# EAGLE design CRBN 60 (EAGLE 9.6.2)
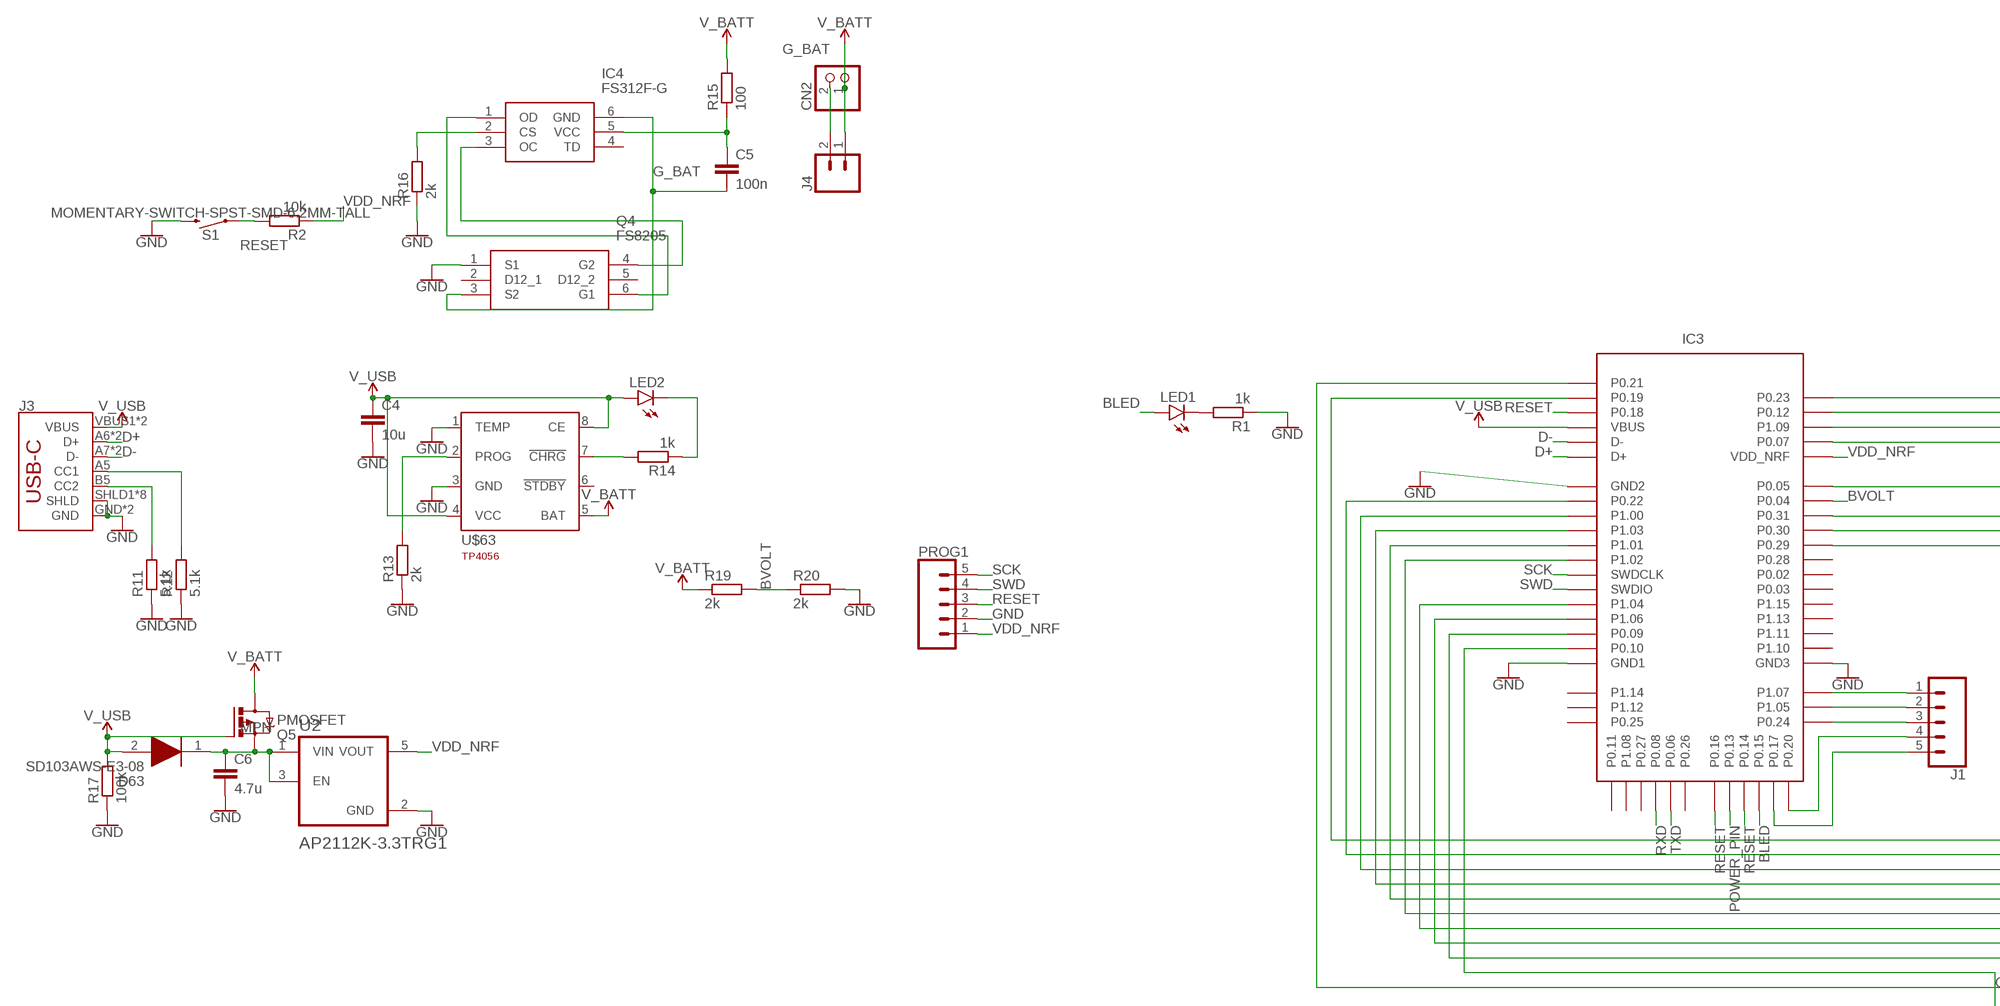
[diagram p0: schematic, sheet 1, part 1 of 2]
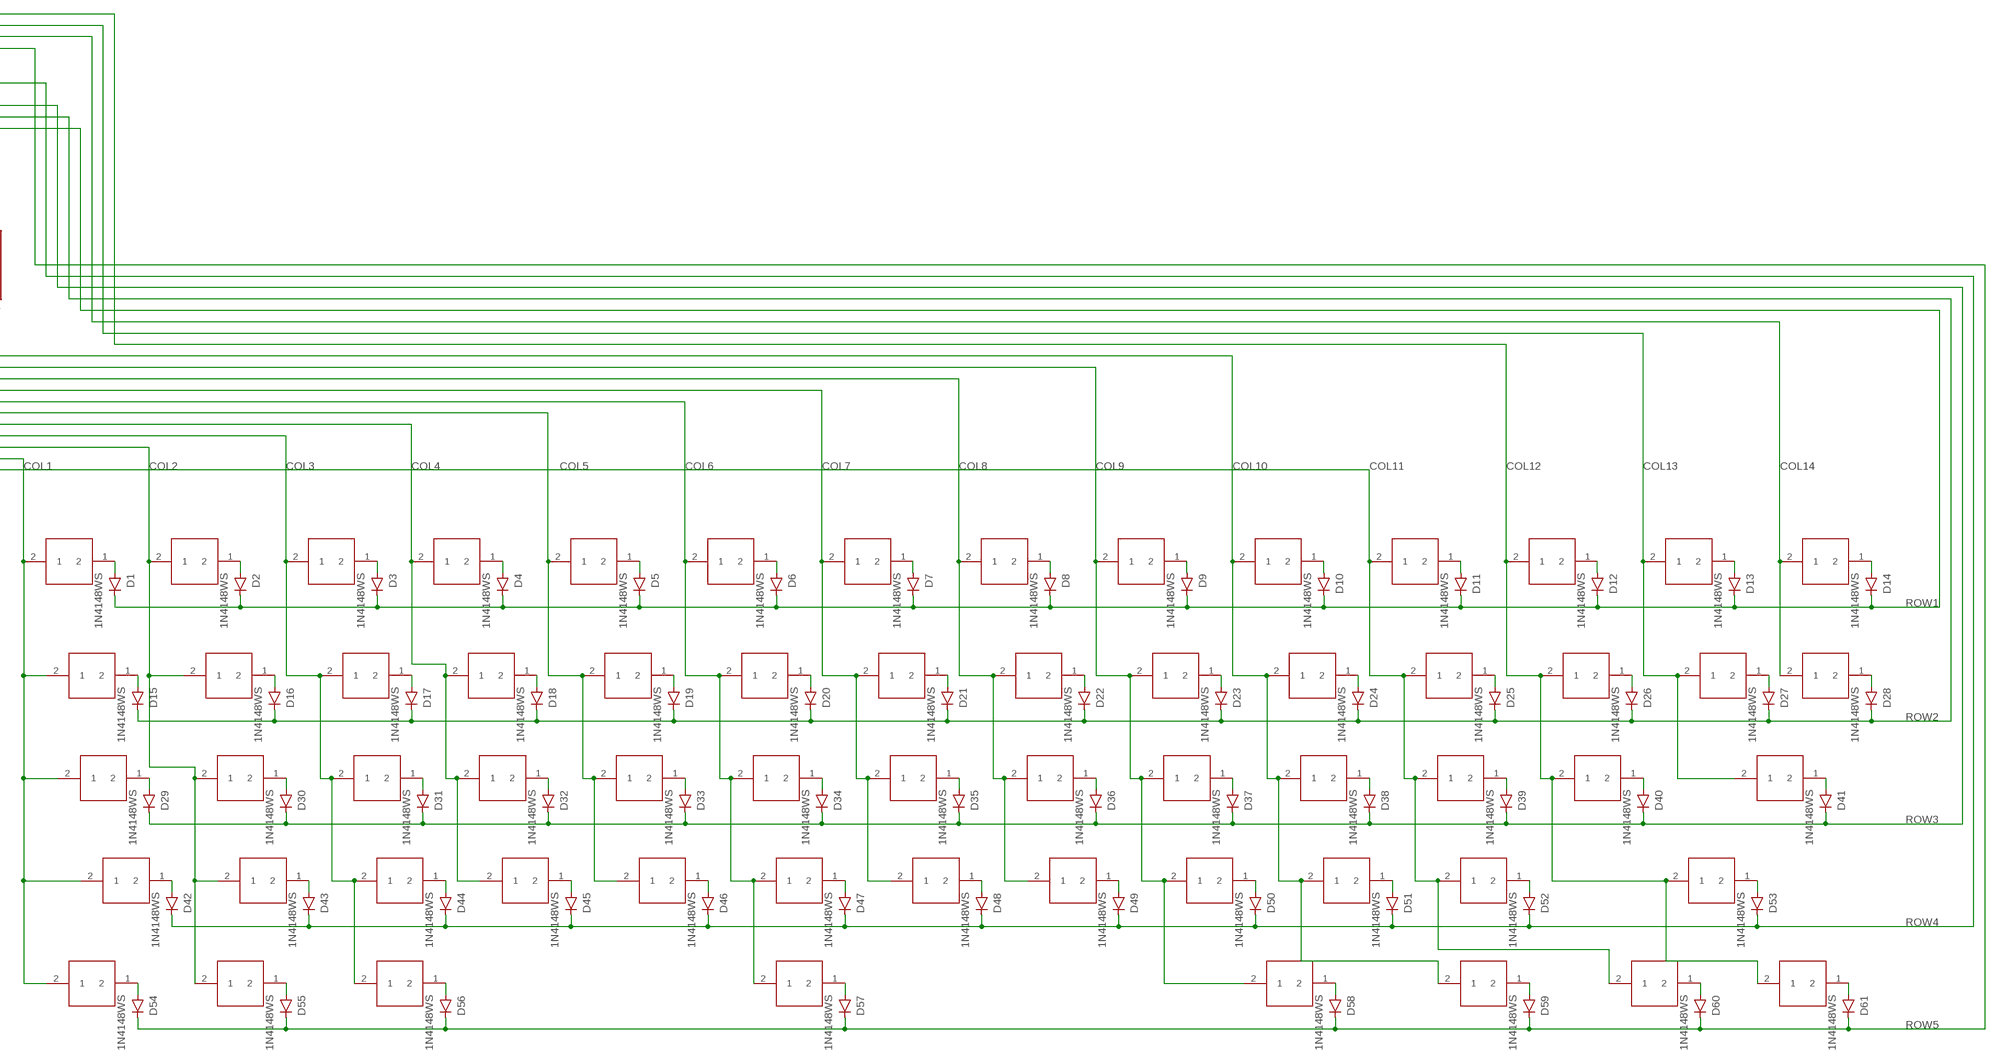
[diagram p1: schematic, sheet 1, part 2 of 2]

## Parts
C4  10u  C-EUC0603  [C0603]
C5  100n  C-EUC0603  [C0603]
C6  4.7u  C-EUC0603  [C0603]
CN2  JST_2PIN-SMT  [JST-PH-2-SMT]
D1  1N4148WS  [SOD-323]
D2  1N4148WS  [SOD-323]
D3  1N4148WS  [SOD-323]
D4  1N4148WS  [SOD-323]
D5  1N4148WS  [SOD-323]
D6  1N4148WS  [SOD-323]
D7  1N4148WS  [SOD-323]
D8  1N4148WS  [SOD-323]
D9  1N4148WS  [SOD-323]
D10  1N4148WS  [SOD-323]
D11  1N4148WS  [SOD-323]
D12  1N4148WS  [SOD-323]
D13  1N4148WS  [SOD-323]
D14  1N4148WS  [SOD-323]
D15  1N4148WS  [SOD-323]
D16  1N4148WS  [SOD-323]
D17  1N4148WS  [SOD-323]
D18  1N4148WS  [SOD-323]
D19  1N4148WS  [SOD-323]
D20  1N4148WS  [SOD-323]
D21  1N4148WS  [SOD-323]
D22  1N4148WS  [SOD-323]
D23  1N4148WS  [SOD-323]
D24  1N4148WS  [SOD-323]
D25  1N4148WS  [SOD-323]
D26  1N4148WS  [SOD-323]
D27  1N4148WS  [SOD-323]
D28  1N4148WS  [SOD-323]
D29  1N4148WS  [SOD-323]
D30  1N4148WS  [SOD-323]
D31  1N4148WS  [SOD-323]
D32  1N4148WS  [SOD-323]
D33  1N4148WS  [SOD-323]
D34  1N4148WS  [SOD-323]
D35  1N4148WS  [SOD-323]
D36  1N4148WS  [SOD-323]
D37  1N4148WS  [SOD-323]
D38  1N4148WS  [SOD-323]
D39  1N4148WS  [SOD-323]
D40  1N4148WS  [SOD-323]
D41  1N4148WS  [SOD-323]
D42  1N4148WS  [SOD-323]
D43  1N4148WS  [SOD-323]
D44  1N4148WS  [SOD-323]
D45  1N4148WS  [SOD-323]
D46  1N4148WS  [SOD-323]
D47  1N4148WS  [SOD-323]
D48  1N4148WS  [SOD-323]
D49  1N4148WS  [SOD-323]
D50  1N4148WS  [SOD-323]
D51  1N4148WS  [SOD-323]
D52  1N4148WS  [SOD-323]
D53  1N4148WS  [SOD-323]
D54  1N4148WS  [SOD-323]
D55  1N4148WS  [SOD-323]
D56  1N4148WS  [SOD-323]
D57  1N4148WS  [SOD-323]
D58  1N4148WS  [SOD-323]
D59  1N4148WS  [SOD-323]
D60  1N4148WS  [SOD-323]
D61  1N4148WS  [SOD-323]
D63  SD103AWS-E3-08  [SOD2713X115N]
IC3  HOLYIOT_18010  [PCBCOMPONENT_1]
IC4  FS312F-G  [SOT95P280X145-6N]
J1  CONN_051.27MM  [1X05_1.27MM]
J3  SPARKFUN-CONNECTORS_USB_C16PIN  [SPARKFUN-CONNECTORS_USB-C-16P]
J4  CONN_02  [1X02]
LED1  LEDSML0603  [SML0603]
LED2  LEDSML0603  [SML0603]
PROG1  CONN_05  [1X05]
Q4  FS8205  [FS8205]
Q5  PMOSFET  PMOSFET_SOT23  [SOT23]
R1  1k  R-EU_R0603  [R0603]
R2  10k  R-EU_R0603  [R0603]
R11  5.1k  R-EU_R0603  [R0603]
R12  5.1k  R-EU_R0603  [R0603]
R13  2k  R-EU_R0603  [R0603]
R14  1k  R-EU_R0603  [R0603]
R15  100  R-EU_R0603  [R0603]
R16  2k  R-EU_R0603  [R0603]
R17  100k  R-EU_R0603  [R0603]
R19  2k  R-EU_R0603  [R0603]
R20  2k  R-EU_R0603  [R0603]
S1  MOMENTARY-SWITCH-SPST-SMD-6.2MM-TALL  [TACTILE_SWITCH_SMD_6.2MM_TALL]
U2  AP2112K-3.3TRG1  [SOT95P285X140-5N]
U$1  CHERRY  [CHERRY]
U$2  CHERRY  [CHERRY]
U$3  CHERRY  [CHERRY]
U$4  CHERRY  [CHERRY]
U$5  CHERRY  [CHERRY]
U$6  CHERRY  [CHERRY]
U$7  CHERRY  [CHERRY]
U$8  CHERRY  [CHERRY]
U$9  CHERRY  [CHERRY]
U$10  CHERRY  [CHERRY]
U$11  CHERRY  [CHERRY]
U$12  CHERRY  [CHERRY]
U$13  CHERRY  [CHERRY]
U$14  CHERRY  [CHERRY]
U$15  CHERRY  [CHERRY]
U$16  CHERRY  [CHERRY]
U$17  CHERRY  [CHERRY]
U$18  CHERRY  [CHERRY]
U$19  CHERRY  [CHERRY]
U$20  CHERRY  [CHERRY]
U$21  CHERRY  [CHERRY]
U$22  CHERRY  [CHERRY]
U$23  CHERRY  [CHERRY]
U$24  CHERRY  [CHERRY]
U$25  CHERRY  [CHERRY]
U$26  CHERRY  [CHERRY]
U$27  CHERRY  [CHERRY]
U$28  CHERRY  [CHERRY]
U$29  CHERRY  [CHERRY]
U$30  CHERRY  [CHERRY]
U$31  CHERRY  [CHERRY]
U$32  CHERRY  [CHERRY]
U$33  CHERRY  [CHERRY]
U$34  CHERRY  [CHERRY]
U$35  CHERRY  [CHERRY]
U$36  CHERRY  [CHERRY]
U$37  CHERRY  [CHERRY]
U$38  CHERRY  [CHERRY]
U$39  CHERRY  [CHERRY]
U$40  CHERRY  [CHERRY]
U$41  CHERRY  [CHERRY]
U$42  CHERRY  [CHERRY]
U$43  CHERRY  [CHERRY]
U$44  CHERRY  [CHERRY]
U$45  CHERRY  [CHERRY]
U$46  CHERRY  [CHERRY]
U$47  CHERRY  [CHERRY]
U$48  CHERRY  [CHERRY]
U$49  CHERRY  [CHERRY]
U$50  CHERRY  [CHERRY]
U$51  CHERRY  [CHERRY]
U$52  CHERRY  [CHERRY]
U$53  CHERRY  [CHERRY]
U$54  CHERRY  [CHERRY]
U$55  CHERRY  [CHERRY]
U$56  CHERRY  [CHERRY]
U$57  CHERRY  [CHERRY]
U$58  CHERRY  [CHERRY]
U$59  CHERRY  [CHERRY]
U$60  CHERRY  [CHERRY]
U$61  CHERRY  [CHERRY]
U$63  TP4056  [SOT23-8]

## Nets
BLED: IC3.P0.15 LED1.A
BVOLT: IC3.P0.04 R19.2 R20.1
COL1: IC3.P0.10 U$1.2 U$15.2 U$29.2 U$42.2 U$54.2
COL2: IC3.P0.09 U$2.2 U$16.2 U$30.2 U$43.2 U$55.2
COL3: IC3.P1.06 U$3.2 U$17.2 U$31.2 U$44.2 U$56.2
COL4: IC3.P1.04 U$4.2 U$18.2 U$32.2 U$45.2
COL5: IC3.P1.02 U$5.2 U$19.2 U$33.2 U$46.2
COL6: IC3.P1.01 U$6.2 U$20.2 U$34.2 U$47.2 U$57.2
COL7: IC3.P1.03 U$7.2 U$21.2 U$35.2 U$48.2
COL8: IC3.P1.00 U$8.2 U$22.2 U$36.2 U$49.2
COL9: IC3.P0.22 U$9.2 U$23.2 U$37.2 U$50.2 U$58.2
COL10: IC3.P0.19 U$10.2 U$24.2 U$38.2 U$51.2 U$59.2
COL11: IC3.P0.21 U$11.2 U$25.2 U$39.2 U$52.2 U$60.2
COL12: IC3.P0.23 U$12.2 U$26.2 U$40.2 U$53.2 U$61.2
COL13: IC3.P0.12 U$13.2 U$27.2 U$41.2
COL14: IC3.P1.09 U$14.2 U$28.2
D+: IC3.D+ J3.A6(D+) J3.B6(D+)
D-: IC3.D- J3.A7(D-) J3.B7(D-)
G_BAT: C5.2 CN2.2 IC4.6(GND) J4.2 Q4.3(S2)
GND: C4.2 C6.2 IC3.GND1(GND2) IC3.GND2(GND3) IC3.GND(GND1) J3.GND J3.GND2(GND) J3.SHLD1(SHLD) J3.SHLD2(SHLD) J3.SHLD3(SHLD) J3.SHLD4(SHLD) J3.SHLD5(SHLD) J3.SHLD6(SHLD) J3.SHLD7(SHLD) J3.SHLD8(SHLD) PROG1.2 Q4.1(S1) R1.1 R11.1 R12.1 R13.1 R16.1 R17.1 R20.2 S1.B2 U2.2(GND) U$63.1(TEMP) U$63.3(GND)
N$1: D1.A U$1.1
N$2: LED1.C R1.2
N$3: D14.A U$14.1
N$4: D13.A U$13.1
N$5: D12.A U$12.1
N$6: D11.A U$11.1
N$7: D10.A U$10.1
N$8: D9.A U$9.1
N$9: D8.A U$8.1
N$10: D7.A U$7.1
N$11: D6.A U$6.1
N$12: D5.A U$5.1
N$13: D4.A U$4.1
N$14: D3.A U$3.1
N$15: D2.A U$2.1
N$16: D15.A U$15.1
N$17: IC3.P1.07 J1.1
N$18: D28.A U$28.1
N$19: D27.A U$27.1
N$20: D26.A U$26.1
N$21: D25.A U$25.1
N$22: D24.A U$24.1
N$23: D23.A U$23.1
N$24: D22.A U$22.1
N$25: D21.A U$21.1
N$26: D20.A U$20.1
N$27: D19.A U$19.1
N$28: D18.A U$18.1
N$29: D17.A U$17.1
N$30: D16.A U$16.1
N$31: D29.A U$29.1
N$32: IC3.P1.05 J1.2
N$33: D41.A U$41.1
N$34: D40.A U$40.1
N$35: D39.A U$39.1
N$36: D38.A U$38.1
N$37: D37.A U$37.1
N$38: D36.A U$36.1
N$39: D35.A U$35.1
N$40: D34.A U$34.1
N$41: D33.A U$33.1
N$42: D32.A U$32.1
N$43: D31.A U$31.1
N$44: D30.A U$30.1
N$45: D42.A U$42.1
N$46: IC3.P0.24 J1.3
N$47: D53.A U$53.1
N$48: D52.A U$52.1
N$49: D51.A U$51.1
N$50: D50.A U$50.1
N$51: D49.A U$49.1
N$52: D48.A U$48.1
N$53: D47.A U$47.1
N$54: D46.A U$46.1
N$55: D45.A U$45.1
N$56: D44.A U$44.1
N$57: D43.A U$43.1
N$58: D54.A U$54.1
N$59: IC3.P0.20 J1.4
N$60: D61.A U$61.1
N$61: D60.A U$60.1
N$62: D59.A U$59.1
N$63: D58.A U$58.1
N$64: D57.A U$57.1
N$65: D56.A U$56.1
N$66: D55.A U$55.1
N$67: IC3.P0.17 J1.5
N$72: J3.B5(CC2) R11.2
N$73: J3.A5(CC1) R12.2
N$74: R13.2 U$63.2(PROG)
N$75: LED2.C R14.1
N$76: R14.2 U$63.7(!CHRG)
N$77: IC4.1(OD) Q4.6(G1)
N$78: IC4.3(OC) Q4.4(G2)
N$79: C5.1 IC4.5(VCC) R15.1
N$80: IC4.2(CS) R16.2
N$81: C6.1 D63.1(K) Q5.2(S) U2.1(VIN) U2.3(EN)
POWER_PIN: IC3.P0.13
RESET: IC3.P0.14 IC3.P0.16 IC3.P0.18 PROG1.3 R2.2 S1.A2
ROW1: D1.C D2.C D3.C D4.C D5.C D6.C D7.C D8.C D9.C D10.C D11.C D12.C D13.C D14.C IC3.P0.29
ROW2: D15.C D16.C D17.C D18.C D19.C D20.C D21.C D22.C D23.C D24.C D25.C D26.C D27.C D28.C IC3.P0.30
ROW3: D29.C D30.C D31.C D32.C D33.C D34.C D35.C D36.C D37.C D38.C D39.C D40.C D41.C IC3.P0.31
ROW4: D42.C D43.C D44.C D45.C D46.C D47.C D48.C D49.C D50.C D51.C D52.C D53.C IC3.P0.05
ROW5: D54.C D55.C D56.C D57.C D58.C D59.C D60.C D61.C IC3.P0.07
RXD: IC3.P0.08
SCK: IC3.SWDCLK PROG1.5
SWD: IC3.SWDIO PROG1.4
TXD: IC3.P0.06
V_BATT: CN2.1 J4.1 Q5.3(D) R15.2 R19.1 U$63.5(BAT)
V_USB: C4.1 D63.2(A) IC3.VBUS J3.VBUS1(VBUS) J3.VBUS2(VBUS) LED2.A Q5.1(G) R17.2 U$63.4(VCC) U$63.8(CE)
VDD_NRF: IC3.VDD_NRF PROG1.1 R2.1 U2.5(VOUT)
Unconnected: IC3.P0.02 IC3.P0.03 IC3.P0.11 IC3.P0.25 IC3.P0.26 IC3.P0.27 IC3.P0.28 IC3.P1.08 IC3.P1.10 IC3.P1.11 IC3.P1.12 IC3.P1.13 IC3.P1.14 IC3.P1.15 IC4.4(TD) Q4.2(D12_1) Q4.5(D12_2) U$63.6(!STDBY)

## Library data of the parts
C4-C6 = resistor:C-EU: CAPACITOR, European symbol
CN2 = adafruit:JST_2PIN: JST 2-Pin Connectors of various flavors SMT-RA (S2B-PH-SM4) 4UConnector #17311 SMT (B2B-PH-SM4) THM-RA (S2B-PH) THM (B2B-PH)
D1-D61 = Diodes:1N4148WS: DIODE GEN PURP 75V 150MA SOD323F Manufacturer's datasheet <https://www.onsemi.com/pub/Collateral/1N914BWS-D.pdf>; CREATED_BY: PCBLayout.com; DIGIKEY_PART_NUMBER: 1N4148WSFSTR-ND; MANUFACTURER: Diodes Incorporated; MPN: 1N4148WS; PACKAGE: SOD-323
D63 = SD103AWS-E3-08:SD103AWS-E3-08: Vishay SD103AWS-E3-08, SMT Schottky Diode, 40V 350mA, 10ns, 2-Pin SOD-323 Source: Datasheet <http://www.vishay.com/docs/85682/sd103aws.pdf>; ARROW_PART_NUMBER: SD103AWS-E3-08; ARROW_PRICE-STOCK: https://www.arrow.com/en/products/sd103aws-e3-08/vishay; DESCRIPTION: Vishay SD103AWS-E3-08, SMT Schottky Diode, 40V 350mA, 10ns, 2-Pin SOD-323; HEIGHT: 1.15mm; MANUFACTURER_NAME: Vishay; MANUFACTURER_PART_NUMBER: SD103AWS-E3-08; MOUSER_PART_NUMBER: 78-SD103AWS-E3-08; MOUSER_PRICE-STOCK: https://www.mouser.co.uk/ProductDetail/Vishay-Semiconductors/SD103AWS-E3-08?qs=S660mHfF5o1xcba7ic5A%252BA%3D%3D
IC3 = HOLYIOT-18010-VER1.0-0.8MM:HOLYIOT_18010
IC4 = FS312F-G:FS312F-G: Battery Protection ICs SOT-23-6 RoHS Source: Datasheet <https://lcsc.com/product-detail/Battery-Protection-ICs_FS312F-G_C82736.html>; DESCRIPTION: Battery Protection ICs SOT-23-6 RoHS; HEIGHT: 1.45mm; MANUFACTURER_NAME: Fortune Semicon; MANUFACTURER_PART_NUMBER: FS312F-G
J1 PROG1 = SparkFun-Connectors:CONN_05: Multi connection point. Often used as Generic Header-pin footprint for 0.1 inch spaced/style header connections On any of the 0.1 inch spaced packages, you can populate with these: Break Away Headers - Straight <https://www.sparkfun.com/products/116> (PRT-00116) Break Away Male Headers - Right Angle <https://www.sparkfun.com/products/553> (PRT-00553) Female Headers <https://www.sparkfun.com/products/115> (PRT-00115) Break Away Headers - Machine Pin <https://www.sparkfun.com/products/117> (PRT-00117) Break Away Female Headers - Swiss Machine Pin <https://www.sparkfun.com/products/743> (PRT-00743) For SCREWTERMINALS and SPRING TERMINALS visit here: Screw Terimnals on SparkFun.com <https://www.sparkfun.com/search/results?term=Screw+Terminals> (5mm/3.5mm/2.54mm spacing) This device is also useful as a general connection point to wire up your design to another part of your project. Our various solder wires solder well into these plated through hole pads. Hook-Up Wire - Assortment (Stranded, 22 AWG) <https://www.sparkfun.com/products/11375> (PRT-11375) Hook-Up Wire - Assortment (Solid Core, 22 AWG) <https://www.sparkfun.com/products/11367> (PRT-11367) View the entire wire category on our website here <https://www.sparkfun.com/categories/141> Special notes: Molex polarized connector foot print use with SKU : PRT-08231 with associated crimp pins and housings. 1MM SMD Version SKU: PRT-10208
J3 = USB-C-Breakout:SPARKFUN-CONNECTORS_USB_C: USB Type C 16Pin Connector Super Speed pins not available on the 16-pin purely SMD connector so this part is best for USB 2.0 implementations. D1 and D2 are tied together enabling D+/- no matter which way the cable is plugged into the connector. The two channel configuration pins (CC1/2) are exposed. These are normally connected to ground via 5.1k resistors but can be reconfigured for high current/high power applications.; PROD_ID: CONN-14122
J4 = SparkFun-Connectors:CONN_02: Multi connection point. Often used as Generic Header-pin footprint for 0.1 inch spaced/style header connections On any of the 0.1 inch spaced packages, you can populate with these: Break Away Headers - Straight <https://www.sparkfun.com/products/116> (PRT-00116) Break Away Male Headers - Right Angle <https://www.sparkfun.com/products/553> (PRT-00553) Female Headers <https://www.sparkfun.com/products/115> (PRT-00115) Break Away Headers - Machine Pin <https://www.sparkfun.com/products/117> (PRT-00117) Break Away Female Headers - Swiss Machine Pin <https://www.sparkfun.com/products/743> (PRT-00743) For SCREWTERMINALS and SPRING TERMINALS visit here: Screw Terimnals on SparkFun.com <https://www.sparkfun.com/search/results?term=Screw+Terminals> (5mm/3.5mm/2.54mm spacing) This device is also useful as a general connection point to wire up your design to another part of your project. Our various solder wires solder well into these plated through hole pads. Hook-Up Wire - Assortment (Stranded, 22 AWG) <https://www.sparkfun.com/products/11375> (PRT-11375) Hook-Up Wire - Assortment (Solid Core, 22 AWG) <https://www.sparkfun.com/products/11367> (PRT-11367) View the entire wire category on our website here <https://www.sparkfun.com/categories/141> Special notes: Molex polarized connector foot print use with: PRT-08233 with associated crimp pins and housings. 2.54_SCREWTERM for use with PRT-10571. 3.5mm Screw Terminal footprints for PRT-08084 5mm Screw Terminal footprints for use with PRT-08432
LED1 LED2 = led:LED: LED OSRAM: - CHIPLED LG R971, LG N971, LY N971, LG Q971, LY Q971, LO R971, LY R971 LH N974, LH R974 LS Q976, LO Q976, LY Q976 LO Q996 - Hyper CHIPLED LW Q18S LB Q993, LB Q99A, LB R99A - SideLED LS A670, LO A670, LY A670, LG A670, LP A670 LB A673, LV A673, LT A673, LW A673 LH A674 LY A675 LS A676, LA A676, LO A676, LY A676, LW A676 LS A679, LY A679, LG A679 - Hyper Micro SIDELED® LS Y876, LA Y876, LO Y876, LY Y876 LT Y87S - SmartLED LW L88C, LW L88S LB L89C, LB L89S, LG L890 LS L89K, LO L89K, LY L89K LS L896, LA L896, LO L896, LY L896 - TOPLED LS T670, LO T670, LY T670, LG T670, LP T670 LSG T670, LSP T670, LSY T670, LOP T670, LYG T670 LG T671, LOG T671, LSG T671 LB T673, LV T673, LT T673, LW T673 LH T674 LS T676, LA T676, LO T676, LY T676, LB T676, LH T676, LSB T676, LW T676 LB T67C, LV T67C, LT T67C, LS T67K, LO T67K, LY T67K, LW E67C LS E67B, LA E67B, LO E67B, LY E67B, LB E67C, LV E67C, LT E67C LW T67C LS T679, LY T679, LG T679 LS T770, LO T770, LY T770, LG T770, LP T770 LB T773, LV T773, LT T773, LW T773 LH T774 LS E675, LA E675, LY E675, LS T675 LS T776, LA T776, LO T776, LY T776, LB T776 LHGB T686 LT T68C, LB T68C - Hyper Mini TOPLED® LB M676 - Mini TOPLED Santana® LG M470 LS M47K, LO M47K, LY M47K Source: http://www.osram.convergy.de LUXEON: - LUMILED® LXK2-PW12-R00, LXK2-PW12-S00, LXK2-PW14-U00, LXK2-PW14-V00 LXK2-PM12-R00, LXK2-PM12-S00, LXK2-PM14-U00 LXK2-PE12-Q00, LXK2-PE12-R00, LXK2-PE12-S00, LXK2-PE14-T00, LXK2-PE14-U00 LXK2-PB12-K00, LXK2-PB12-L00, LXK2-PB12-M00, LXK2-PB14-N00, LXK2-PB14-P00, LXK2-PB14-Q00 LXK2-PR12-L00, LXK2-PR12-M00, LXK2-PR14-Q00, LXK2-PR14-R00 LXK2-PD12-Q00, LXK2-PD12-R00, LXK2-PD12-S00 LXK2-PH12-R00, LXK2-PH12-S00 LXK2-PL12-P00, LXK2-PL12-Q00, LXK2-PL12-R00 Source: www.luxeon.com KINGBRIGHT: KA-3528ASYC Source: www.kingbright.com
Q4 = FS8205:FS8205: DUAL N-CHANNEL ENHANCEMENT MODE POWER MOFSET Source: Datasheet <https://www.ic-fortune.com/upload/Download/FS8205-DS-19_EN.pdf>; DESCRIPTION: DUAL N-CHANNEL ENHANCEMENT MODE POWER MOFSET; HEIGHT: 1mm; MANUFACTURER_NAME: Fortune Semiconductor Corporation; MANUFACTURER_PART_NUMBER: FS8205
Q5 = Transistor:PMOSFET: P-Channel MOSFET - Generic; CATEGORY: Transistor; MPN: SL2301S; SUB-CATEGORY: MOSFET; TYPE: P-Channel
R1 R2 R11-R17 R19 R20 = rcl:R-EU_: RESISTOR, European symbol; SPICEPREFIX: R
S1 = SparkFun-Switches:MOMENTARY-SWITCH-SPST: Momentary Switch (Pushbutton) - SPST Normally-open (NO) SPST momentary switches (buttons, pushbuttons). Variants PTH-12MM - 12mm square, through-hole Momentary Pushbutton Switch - 12mm Square <https://www.sparkfun.com/products/9190> (COM-09190) PTH-6.0MM, PTH-6.0MM-KIT - 6.0mm square, through-hole Mini Pushbutton Switch <https://www.sparkfun.com/products/97> (COM-00097) KIT package intended for soldering kit's - only one side of pads' copper is exposed. PTH-RIGHT-ANGLE-KIT - Right-angle, through-hole Right Angle Tactile Button <https://www.sparkfun.com/products/10791> - Used on SparkFun BigTime Watch Kit <https://www.sparkfun.com/products/11734> SMD-12MM - 12mm square, surface-mount Tactile Button - SMD (12mm) <https://www.sparkfun.com/products/12993> (COM-12993) Used on SparkFun PicoBoard <https://www.sparkfun.com/products/11888> SMD-4.5MM - 4.5mm Square Trackball Switch Used on SparkFun Blackberry Trackballer Breakout <https://www.sparkfun.com/products/13169> SMD-4.6MMX2.8MM - 4.60mm x 2.80mm, surface mount Used on SparkFun SAMD21 Mini Breakout <https://www.sparkfun.com/products/13664> SMD-5.2MM, SMD-5.2-REDUNDANT - 5.2mm square, surface-mount Mini Pushbutton Switch - SMD <https://www.sparkfun.com/products/8720> (COM-08720) Used on Arduino Pro Mini <https://www.sparkfun.com/products/11114> REDUNDANT package connects both switch circuits together SMD-6.0X3.5MM - 6.0 x 3.5mm, surface mount Momentary Reset Switch SMD <https://www.sparkfun.com/products/8229> (COM-08229) SMD-6.2MM-TALL - 6.2mm square, surface mount Tactile Button - SMD (6mm) <https://www.sparkfun.com/products/12992> Used on SparkFun Digital Sandbox <https://www.sparkfun.com/products/12651> SMD-RIGHT-ANGLE - Right-angle, surface mount Used on SparkFun Block for Intel® Edison - Arduino <https://www.sparkfun.com/products/13036>; PROD_ID: SWCH-11966; SF_SKU: COM-12992
U2 = AP2112K-3.3TRG1:AP2112K-3.3TRG1: AP2112 Series 0.6 A 3.3 V Fixed Output SMT LDO Linear Regulator - SOT23-5 Check prices <https://pricing.snapeda.com/parts/AP2112K-3.3TRG1/Diodes%20Inc./view-part?ref=eda>; AVAILABILITY: Good; DESCRIPTION: Linear Voltage Regulator IC 1 Output 600mA SOT-25; MF: Diodes Inc.; MP: AP2112K-3.3TRG1; PACKAGE: SOT-753 Diodes Inc.; PRICE: None; PURCHASE-URL: https://pricing.snapeda.com/search/part/AP2112K-3.3TRG1/?ref=eda
U$1-U$61 = Volume_V1:CHERRY
U$63 = TP4056:TP4056: TP4056 Data sheet <http://goo.gl/J7k8TF> Dave.Calaway Eagle Library <https://goo.gl/Muy1Tr>

## Board
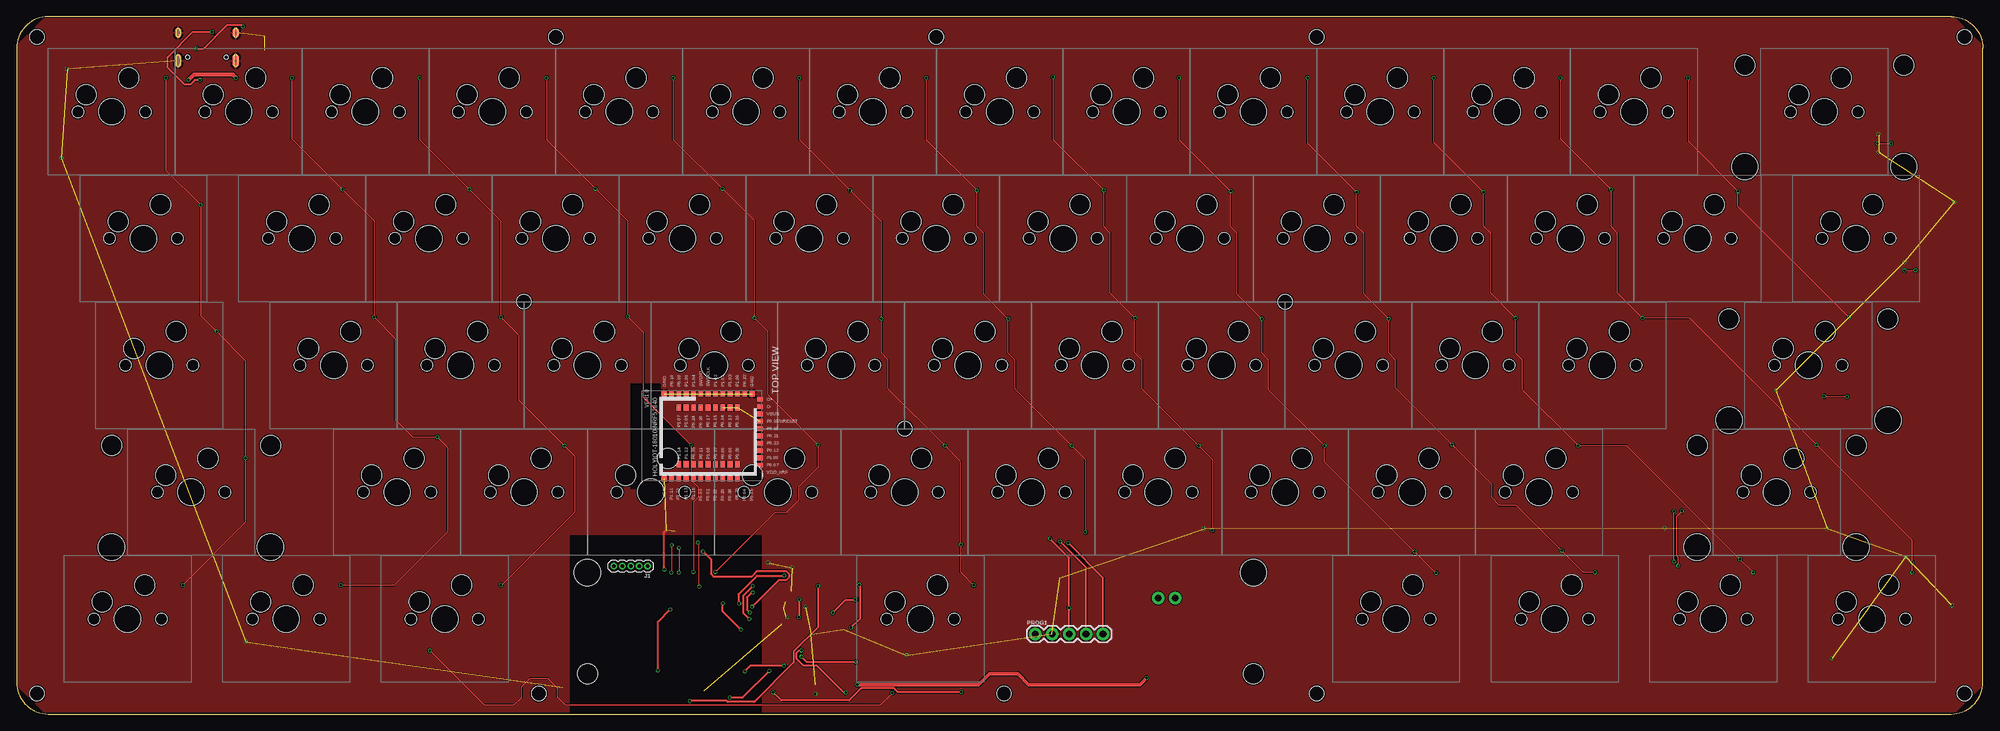
[diagram p2: board, top side]
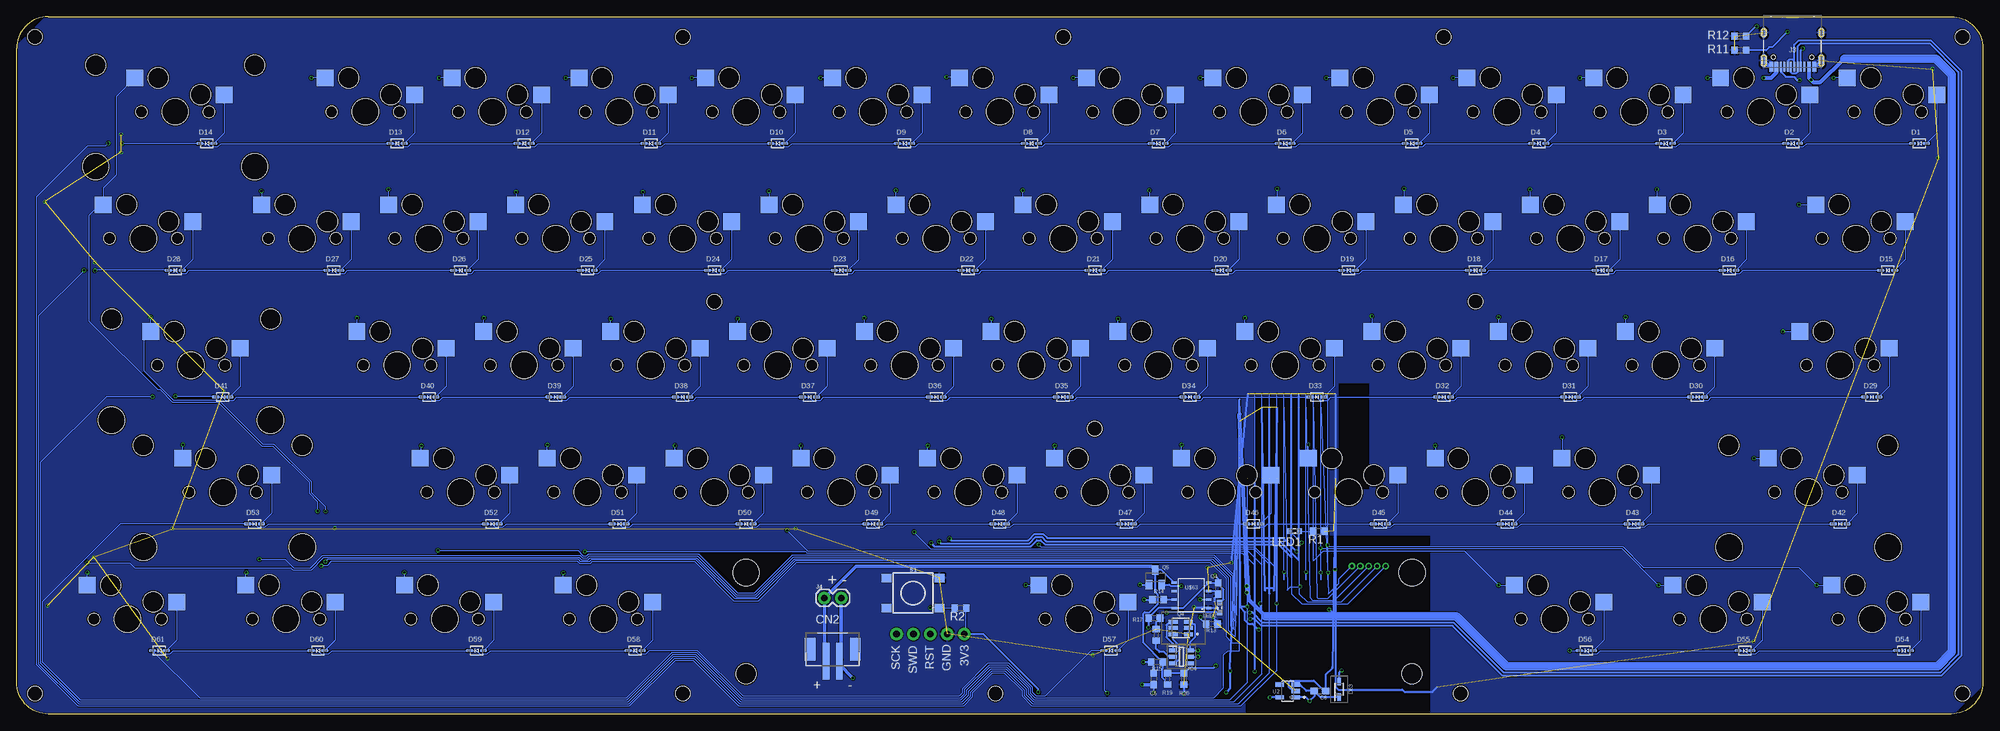
[diagram p3: board, bottom side, seen from below]

Size 295.28 x 104.78 mm. Coordinates in mm from the lower left corner, seen from the top.
Outline: 0,100.01 0,4.76 arc90 4.76,0 290.51,0 arc90 295.28,4.76 295.28,100.01 arc90 290.51,104.78 4.76,104.78 arc90 0,100.01
Copper layers (1*16): Top 0.035559375mm / dielectric 1.6mm / Bottom 0.035559375mm
Design rules "jlcpcb2layer": minimum track width 5mil, minimum drill 12mil, track to track 5mil, track to pad 5mil, pad to pad 5mil, via to via 5mil, smd to smd 5mil, copper to edge 8mil, drill to drill 6mil, minimum pad ring 5mil, minimum via ring 3mil, stop-mask expansion 2.5mil, vias tented up to drill 0mil, thermal gap 10mil
Holes 3.05 mm at 38.13,40.32 14.26,40.32 276.26,40.32 252.38,40.32 281.02,59.37 257.14,59.37 283.4,97.47 259.52,97.47 185.73,6.03 85.73,6.03
Holes 3.99 mm at 38.13,25.08 14.26,25.08 276.26,25.08 252.38,25.08 281.02,44.13 257.14,44.13 283.4,82.23 259.52,82.23 185.73,21.27 85.73,21.27
Holes 2.2 mm at 3.08,3.08 3.08,101.7 292.51,101.7 292.51,3.08 138.11,101.7 80.96,101.7 195.26,101.7 78.42,3.08 148.27,3.08 195.26,3.08 76.2,61.97 133.35,42.86 190.5,61.91

### Footprints (pad centres in the part's own frame; a part is rotated, then mirrored left to right if it is on the bottom)
C0603 = smd 1.1 x 1: 1 -0.85,0; 2 0.85,0
JST-PH-2-SMT = smd 1 x 5.5: 1 -1,-1.8; 2 1,-1.8 | smd 1.6 x 3.4: NC1 -3.4,0; NC2 3.4,0
SOD-323 = smd 1.14 x 0.52: A 1.04,0; C -1.04,0
SOD2713X115N = smd 1.125 x 0.5: 1 -1.162,0; 2 1.162,0
PCBCOMPONENT_1 = smd 0.7 x 0.9: D+ 40.127,0.284; D- 39.027,0.284; P0.07 30.227,0.284; P0.12 32.427,0.284; P0.18 36.827,0.284; P0.19 35.727,0.284; P0.21 34.627,0.284; P0.23 33.527,0.284; P1.09 31.327,0.284; VBUS 37.927,0.284; VDD_NRF 29.127,0.284 | smd 0.9 x 0.7: GND 28.277,14.684; GND1 40.977,1.484; GND2 40.977,14.684; P0.02 28.277,8.084; P0.03 28.277,9.184; P0.04 28.277,2.584; P0.05 28.277,1.484; P0.09 40.977,12.484; P0.10 40.977,13.584; P0.22 40.977,2.584; P0.28 28.277,6.984; P0.29 28.277,5.884; P0.30 28.277,4.784; P0.31 28.277,3.684; P1.00 40.977,3.684; P1.01 40.977,5.884; P1.02 40.977,6.984; P1.03 40.977,4.784; P1.04 40.977,10.284; P1.06 40.977,11.384; P1.10 28.277,12.484; P1.11 28.277,13.584; P1.13 28.277,11.384; P1.15 28.277,10.284; SWDCLK 40.977,8.084; SWDIO 40.977,9.184 | smd 1 x 0.7: P0.06 30.377,4.784; P0.08 30.377,5.884; P0.11 30.377,9.184; P0.13 38.877,4.784; P0.14 38.877,5.884; P0.15 38.877,6.984; P0.16 38.877,3.684; P0.17 38.877,8.084; P0.25 30.377,10.284; P0.26 30.377,3.684; P0.27 30.377,6.984; P1.05 38.877,11.384; P1.07 38.877,12.484; P1.08 30.377,8.084; P1.12 30.377,11.384; P1.14 30.377,12.484 | smd 1 x 0.6: P0.20 38.877,9.184; P0.24 38.877,10.284
SOT95P280X145-6N = smd 1.2 x 0.6: 1 -1.25,0.95; 2 -1.25,0; 3 -1.25,-0.95; 4 1.25,-0.95; 5 1.25,0; 6 1.25,0.95
1X05_1.27MM = drill 0.508 pad 1: 1 0,0; 2 1.27,0; 3 2.54,0; 4 3.81,0; 5 5.08,0
SPARKFUN-CONNECTORS_USB-C-16P = smd 0.3 x 1.45: A5 -1.25,0; A6 -0.25,0; A7 0.25,0; A8 1.25,0; B5 1.75,0; B6 0.75,0; B7 -0.75,0; B8 -1.75,0 | smd 0.6 x 1.45: GND -3.225,0; GND2 3.225,0 | smd 1 x 2.1: SHLD1 -4.32,-0.915; SHLD2 4.32,-0.915 | smd 1 x 2.1 bottom: SHLD3 -4.32,-0.915; SHLD4 4.32,-0.915 | smd 1 x 1.6: SHLD5 -4.32,-5.095; SHLD8 4.32,-5.095 | smd 1 x 1.6 bottom: SHLD6 -4.32,-5.095; SHLD7 4.32,-5.095 | smd 0.55 x 1.45: VBUS1 -2.45,0; VBUS2 2.45,0 | hole 0.65: -2.89,-1.445; 2.89,-1.445
1X02 = drill 1.016 pad 1.88: 1 0,0; 2 2.54,0
SML0603 = smd 0.8 x 0.8: A 0.75,0; C -0.75,0
1X05 = drill 1.016 pad 1.88: 1 0,0; 2 2.54,0; 3 5.08,0; 4 7.62,0; 5 10.16,0
FS8205 = smd 1.4 x 0.6: 1 -0.5,0.95; 2 -0.5,0; 3 -0.5,-0.95; 4 1.8,0.95; 5 1.8,0; 6 1.8,-0.95
SOT23 = smd 1 x 1.4: 1 -0.95,-1.1; 2 0.95,-1.1; 3 0,1.1
R0603 = smd 1 x 1.1: 1 -0.85,0; 2 0.85,0
TACTILE_SWITCH_SMD_6.2MM_TALL = smd 1.55 x 1.3: A1 -3.975,-2.25; A2 3.975,-2.25; B1 -3.975,2.25; B2 3.975,2.25
SOT95P285X140-5N = smd 1.35 x 0.6: 1 -1.185,0.95; 2 -1.185,0; 3 -1.185,-0.95; 4 1.185,-0.95; 5 1.185,0.95
CHERRY = smd 2.55 x 2.5 bottom: 1 -7.37,2.54; 2 6.05,5.08 | hole 3.988: 0,0 | hole 1.753: 5.08,0; -5.08,0 | hole 3.048: -3.81,2.54; 2.54,5.08
SOT23-8 = smd 0.42 x 0.835: 1 -1.905,-2.58; 2 -0.635,-2.58; 3 0.635,-2.58; 4 1.905,-2.58; 5 1.905,2.58; 6 0.635,2.58; 7 -0.635,2.58; 8 -1.905,2.58

### Placement (x,y rotation side)
C4  114.83,18.85 270 bottom
C5  124.5,5.26 270 bottom
C6  99.56,3.46 0 bottom
CN2  172.73,9.73 0 bottom
D1  9.52,85.72 0 bottom
D2  28.57,85.72 0 bottom
D3  47.62,85.72 0 bottom
D4  66.67,85.72 0 bottom
D5  85.72,85.72 0 bottom
D6  104.77,85.72 0 bottom
D7  123.82,85.72 0 bottom
D8  142.88,85.72 0 bottom
D9  161.92,85.72 0 bottom
D10  180.97,85.72 0 bottom
D11  200.03,85.72 0 bottom
D12  219.07,85.72 0 bottom
D13  238.12,85.72 0 bottom
D14  266.7,85.72 0 bottom
D15  14.29,66.67 0 bottom
D16  38.1,66.67 0 bottom
D17  57.15,66.67 0 bottom
D18  76.2,66.67 0 bottom
D19  95.25,66.67 0 bottom
D20  114.3,66.67 0 bottom
D21  133.35,66.67 0 bottom
D22  152.4,66.67 0 bottom
D23  171.45,66.67 0 bottom
D24  190.5,66.67 0 bottom
D25  209.55,66.67 0 bottom
D26  228.6,66.67 0 bottom
D27  247.65,66.67 0 bottom
D28  271.46,66.67 0 bottom
D29  16.67,47.62 0 bottom
D30  42.86,47.62 0 bottom
D31  61.91,47.62 0 bottom
D32  80.96,47.62 0 bottom
D33  100.01,47.62 0 bottom
D34  119.06,47.62 0 bottom
D35  138.11,47.62 0 bottom
D36  157.16,47.62 0 bottom
D37  176.21,47.62 0 bottom
D38  195.26,47.62 0 bottom
D39  214.31,47.62 0 bottom
D40  233.36,47.62 0 bottom
D41  264.32,47.62 0 bottom
D42  21.43,28.57 0 bottom
D43  52.39,28.57 0 bottom
D44  71.44,28.57 0 bottom
D45  90.49,28.57 0 bottom
D46  109.54,28.57 0 bottom
D47  128.59,28.57 0 bottom
D48  147.64,28.57 0 bottom
D49  166.69,28.57 0 bottom
D50  185.74,28.57 0 bottom
D51  204.79,28.57 0 bottom
D52  223.84,28.57 0 bottom
D53  259.56,28.57 0 bottom
D54  11.91,9.53 0 bottom
D55  35.72,9.53 0 bottom
D56  59.53,9.53 0 bottom
D57  130.97,9.53 0 bottom
D58  202.41,9.53 0 bottom
D59  226.22,9.53 0 bottom
D60  250.03,9.53 0 bottom
D61  273.84,9.53 0 bottom
D63  96.66,3.7 90 bottom
IC3  111.92,7.14 90 top
IC4  120.36,8.6 0 bottom
J1  94.75,22.23 180 top
J3  28.57,97.25 180 bottom
J4  173.98,17.42 0 bottom
LED1  103.39,27.46 180 bottom
LED2  114.6,16 90 bottom
PROG1  152.98,12.01 0 top
Q4  119.8,12.93 180 bottom
Q5  124.27,20.54 0 bottom
R1  99.71,27.46 180 bottom
R2  153.53,15.9 180 bottom
R11  36.42,99.73 0 bottom
R12  36.42,101.82 0 bottom
R13  115.79,13.52 180 bottom
R14  123.84,17.2 0 bottom
R15  124.02,7.8 0 bottom
R16  124.15,11.91 270 bottom
R17  124.43,14.43 180 bottom
R19  122.42,5.26 90 bottom
R20  119.97,5.26 270 bottom
S1  160.67,18.19 0 bottom
U2  104.39,3.46 180 bottom
U$1  14.29,90.49 0 top
U$2  33.34,90.49 0 top
U$3  52.39,90.49 0 top
U$4  71.44,90.49 0 top
U$5  90.49,90.49 0 top
U$6  109.54,90.49 0 top
U$7  128.59,90.49 0 top
U$8  147.64,90.49 0 top
U$9  166.69,90.49 0 top
U$10  185.74,90.49 0 top
U$11  204.79,90.49 0 top
U$12  223.84,90.49 0 top
U$13  242.89,90.49 0 top
U$14  271.46,90.49 0 top
U$15  19.05,71.44 0 top
U$16  42.86,71.44 0 top
U$17  61.91,71.44 0 top
U$18  80.96,71.44 0 top
U$19  100.01,71.44 0 top
U$20  119.06,71.44 0 top
U$21  138.11,71.44 0 top
U$22  157.16,71.44 0 top
U$23  176.24,71.44 0 top
U$24  195.26,71.44 0 top
U$25  214.31,71.44 0 top
U$26  233.36,71.44 0 top
U$27  252.41,71.44 0 top
U$28  276.23,71.44 0 top
U$29  21.43,52.39 0 top
U$30  47.62,52.39 0 top
U$31  66.67,52.39 0 top
U$32  85.72,52.39 0 top
U$33  104.77,52.39 0 top
U$34  123.82,52.39 0 top
U$35  142.88,52.39 0 top
U$36  161.92,52.39 0 top
U$37  180.97,52.39 0 top
U$38  200.03,52.39 0 top
U$39  219.07,52.39 0 top
U$40  238.12,52.39 0 top
U$41  269.08,52.39 0 top
U$42  26.19,33.34 0 top
U$43  57.15,33.34 0 top
U$44  76.2,33.34 0 top
U$45  95.25,33.34 0 top
U$46  114.3,33.34 0 top
U$47  133.35,33.34 0 top
U$48  152.4,33.34 0 top
U$49  171.45,33.34 0 top
U$50  190.5,33.34 0 top
U$51  209.55,33.34 0 top
U$52  228.6,33.34 0 top
U$53  264.32,33.34 0 top
U$54  16.67,14.29 0 top
U$55  40.48,14.29 0 top
U$56  64.29,14.29 0 top
U$57  135.73,14.29 0 top
U$58  207.17,14.29 0 top
U$59  230.98,14.29 0 top
U$60  254.79,14.29 0 top
U$61  278.61,14.29 0 top
U$63  118.84,17.83 90 bottom

### Tracks (layer width: path | path; a pad name or v marks a point on that pad's centre or on a via)
BLED  (via drill 0.35)  (1 unrouted)
  Top 0.152: v102.5,19.11 102.5,24.14 102.47,24.17 102.47,25.56 v102.3,25.73
  Bottom 0.152: IC3.P0.15 104.41,18.6 104.41,18.68 103.98,19.11 v102.5,19.11 | v102.3,25.73 104.03,27.46 LED1.A
BVOLT  (via drill 0.35)  (1 unrouted)
  Top 0.305: v115.2,7.25 110.17,7.25 v109.33,6.41
  Bottom 0.305: R19.2 R20.1 119.11,6.97 115.48,6.97 v115.2,7.25 | v109.33,6.41 109.33,7.48 IC3.P0.04
COL1  (via drill 0.35)  (1 unrouted)
  Top 0.152: v22.42,95.57 22.42,81.72 v27.62,76.52 27.62,59.88 v30.04,57.47 34.35,53.15 v34.35,38.42 34.35,28.77 v24.96,19.37 | v98.36,25.38 98.36,21.27 v98.34,21.25
  Bottom 0.152: U$1.2 v22.42,95.57 | v27.62,76.52 U$15.2 | v30.04,57.47 U$29.2 | v34.35,38.42 U$42.2 | U$54.2 v24.96,19.37 27.58,22 50.9,22 53.99,25.08 98.06,25.08 v98.36,25.38 | v98.34,21.25 98.34,20.18 IC3.P0.10
COL2  (via drill 0.35)  (1 unrouted)
  Top 0.152: v41.34,95.57 41.34,86.42 v48.96,78.8 53.66,74.11 v53.66,59.63 56.83,56.45 56.83,44.26 59.5,41.59 v63.18,41.59 64.71,40.07 64.71,27.37 56.71,19.37 v48.7,19.37 | v99.48,24.95 99.48,21.3 v99.43,21.25
  Bottom 0.152: U$2.2 v41.34,95.57 | v48.96,78.8 48.96,76.56 U$16.2 | v53.66,59.63 53.68,59.61 U$30.2 | v63.18,41.59 63.18,38.44 U$43.2 | U$55.2 v48.7,19.37 54.11,24.78 99.3,24.78 v99.48,24.95 | v99.43,21.25 99.43,20.19 IC3.P0.09
COL3  (via drill 0.35)  (1 unrouted)
  Top 0.152: v60.52,95.57 60.52,86.3 v68.01,78.8 72.71,74.11 v72.71,59.63 75.37,56.96 75.37,47.18 v82.23,40.32 83.76,38.8 83.76,30.29 72.83,19.37 v72.71,19.37
  Bottom 0.152: U$3.2 v60.52,95.57 | v68.01,78.8 68.01,76.56 U$17.2 | v72.71,59.63 72.73,59.61 U$31.2 | v82.23,40.32 82.25,40.3 U$44.2 | U$56.2 v72.71,19.37 77.81,24.47 99.1,24.47 100.53,23.04 IC3.P1.06
COL4  (via drill 0.35)  (1 unrouted)
  Top 0.152: v79.57,95.57 79.57,86.3 v86.93,78.93 91.76,74.11 v91.76,59.75 94.17,57.34 94.17,47.56 v101.28,40.45 101.28,35.17 102.3,34.15 102.3,32.52 101.64,31.86 v101.64,21.35
  Bottom 0.152: U$4.2 v79.57,95.57 | v86.93,78.93 86.93,76.6 U$18.2 | v91.76,59.75 91.77,59.74 U$32.2 | U$45.2 101.3,40.43 v101.28,40.45 | v101.64,21.35 101.64,20.18 IC3.P1.04
COL5  (via drill 0.35)  (1 unrouted)
  Top 0.152: v98.62,95.57 98.62,86.3 v105.98,78.93 110.81,74.11 v110.81,59.5 112.84,57.47 112.84,47.94 v120.33,40.45 120.33,37.07 117.39,34.13 117.39,32.06 115.58,30.25 113.84,30.25 v104.94,21.35
  Bottom 0.152: U$5.2 v98.62,95.57 | v105.98,78.93 105.98,76.6 U$19.2 | U$33.2 110.82,59.48 v110.81,59.5 | U$46.2 120.35,40.43 v120.33,40.45 | v104.94,21.35 104.94,20.19 IC3.P1.02
COL6  (via drill 0.35)  (1 unrouted)
  Top 0.152: v117.54,95.57 117.54,86.3 v125.16,78.68 129.86,73.98 v129.86,59.37 129.86,54.22 130.87,53.2 130.87,48.83 v139.38,40.32 141.77,37.94 v141.77,25.44 141.77,21.32 v143.73,19.37
  Bottom 0.152: U$6.2 v117.54,95.57 | v125.16,78.68 125.16,76.56 U$20.2 | U$34.2 129.88,59.35 v129.86,59.37 | U$47.2 139.4,40.3 v139.38,40.32 | v141.77,25.44 141.47,25.13 109.36,25.13 106.03,21.81 IC3.P1.01 | v143.73,19.37 U$57.2
COL7  (via drill 0.35)  (1 unrouted)
  Top 0.152: v136.59,95.57 136.59,86.3 v144.21,78.68 144.21,73.2 145.16,72.25 145.16,63.12 v148.91,59.37 148.91,54.22 149.92,53.2 149.92,48.83 v158.43,40.32 160.49,38.27 v160.49,27.32
  Bottom 0.152: U$7.2 v136.59,95.57 | v144.21,78.68 144.21,76.56 U$21.2 | U$35.2 148.91,57.48 v148.91,59.37 | U$48.2 158.45,40.3 v158.43,40.32 | IC3.P1.03 107.12,20.19 107.12,22.47 109.49,24.83 158,24.83 v160.49,27.32
COL8  (via drill 0.35)  (1 unrouted)
  Top 0.152: v155.64,95.69 155.64,86.3 v163.26,78.68 163.26,73.2 164.21,72.25 164.21,63.25 167.89,59.56 | v167.96,59.5 167.89,59.56 | 167.89,59.56 167.89,54.28 168.97,53.2 168.97,48.83 v177.48,40.32 179.57,38.24 v179.57,27.6
  Bottom 0.152: U$8.2 153.81,95.69 v155.64,95.69 | v163.26,78.68 163.26,76.56 U$22.2 | U$36.2 167.98,59.48 v167.96,59.5 | U$49.2 177.5,40.3 v177.48,40.32 | IC3.P1.00 108.23,22.41 110.35,24.52 176.49,24.52 v179.57,27.6
COL9  (via drill 0.35)  (1 unrouted)
  Top 0.152: v174.56,95.57 174.56,86.3 v182.31,78.55 182.31,73.23 183.29,72.25 183.29,63.09 v187.01,59.37 187.01,54.22 188.02,53.2 188.02,48.7 v196.41,40.32 196.41,37.91 v209.93,24.38 209.98,24.38 v213.17,21.2
  Bottom 0.152: U$9.2 v174.56,95.57 | v182.31,78.55 182.31,76.54 U$23.2 | U$37.2 187.03,59.35 v187.01,59.37 | U$50.2 196.41,38.56 v196.41,40.32 | U$58.2 213.22,21.15 v213.17,21.2 | IC3.P0.22 109.33,22.31 111.24,24.22 176.62,24.22 176.76,24.36 209.91,24.36 v209.93,24.38
COL10  (via drill 0.35)  (1 unrouted)
  Top 0.152: v193.87,95.57 193.87,85.79 v201.23,78.42 201.23,73.33 202.31,72.25 202.31,63.12 v206.06,59.37 206.06,54.22 207.07,53.2 207.07,48.96 v215.58,40.45 221.55,34.48 221.55,32.52 222.7,31.37 225.22,31.37 v232,24.59 235.32,21.27 v237.05,21.27
  Bottom 0.152: U$10.2 v193.87,95.57 | v201.23,78.42 201.23,76.6 U$24.2 | U$38.2 206.07,59.35 v206.06,59.37 | U$51.2 215.58,38.44 v215.58,40.45 | U$59.2 237.03,21.26 v237.05,21.27 | v232,24.59 210.99,24.59 210.18,23.78 209.68,23.78 209.4,24.05 192.88,24.05 187.01,18.19 184.45,18.19 178.73,23.91 115.46,23.91 112.41,20.87 112.41,15.35 111.98,14.93 IC3.P0.19
COL11  (via drill 0.35)  (1 unrouted)
  Top 0.152: v212.79,95.57 212.79,85.92 v220.28,78.42 220.28,73.33 221.36,72.25 221.36,63.25 v225.11,59.5 225.11,54.22 226.12,53.2 226.12,48.7 v234.51,40.32 241.74,40.32 v258.81,23.25 v260.79,21.27
  Bottom 0.152: U$11.2 v212.79,95.57 | v220.28,78.42 220.28,76.6 U$25.2 | U$39.2 225.13,59.48 v225.11,59.5 | U$52.2 234.51,38.56 v234.51,40.32 | U$60.2 260.84,21.22 v260.79,21.27 | v258.81,23.25 254.92,23.25 253.66,22 251.1,22 249.29,23.81 210.65,23.81 210.31,23.47 209.55,23.47 209.28,23.75 193,23.75 187.14,17.88 184.33,17.88 178.6,23.61 115.58,23.61 112.71,20.74 112.71,14.36 112.18,13.83 IC3.P0.21
COL12  (via drill 0.35)  (1 unrouted)
  Top 0.152: v231.84,95.57 231.84,86.42 v239.46,78.8 239.46,73.2 240.41,72.25 240.41,63.25 v244.16,59.5 251.27,59.5 v270.32,40.45 284.67,26.1 v284.67,22.75 v284.67,21.27
  Bottom 0.152: U$12.2 v231.84,95.57 | U$26.2 239.41,78.76 v239.46,78.8 | U$40.2 244.17,59.48 v244.16,59.5 | U$53.2 270.32,38.47 v270.32,40.45 | U$61.2 284.66,21.26 v284.67,21.27 | v284.67,22.75 278.28,22.75 277.54,22 254.09,22 253.79,21.69 250.98,21.69 249.16,23.51 210.77,23.51 210.43,23.17 209.43,23.17 209.15,23.44 193.13,23.44 187.26,17.58 184.2,17.58 178.47,23.3 115.71,23.3 113.02,20.61 113.02,13.25 112.5,12.73 IC3.P0.23
COL13  (via drill 0.35)  (1 unrouted)
  Top 0.152: v251.02,95.57 251.02,86.04 v258.51,78.55 258.51,76.26 v275.15,59.63 | v248.88,22.9 v248.88,30.44
  Bottom 0.152: U$13.2 v251.02,95.57 | v258.51,78.55 258.51,76.56 U$27.2 | U$41.2 275.13,57.54 | 275.13,57.54 275.13,59.61 v275.15,59.63 | IC3.P0.12 112.34,11.63 113.32,12.61 113.32,20.49 115.83,23 178.35,23 184.07,17.27 187.39,17.27 193.26,23.14 209.02,23.14 209.3,22.86 210.56,22.86 210.9,23.2 248.58,23.2 v248.88,22.9 | v248.88,30.44 248.88,31.14 250.98,33.24 250.98,34.91 256.61,40.53 258.27,40.53 264.88,47.14 271.69,47.14 276.13,51.57 276.13,56.55 275.13,57.54
COL14  (via drill 0.35)  (1 unrouted)
  Top 0.152: v249.54,22.27 249.54,23.56 249.29,23.8 249.29,29.69 v250.08,30.47
  Bottom 0.152: 282.28,76.62 282.28,78.99 280.31,80.95 280.31,92.77 U$14.2 | 282.28,76.62 U$28.2 | IC3.P1.09 111.73,10.63 112.66,10.63 113.63,11.6 113.63,20.36 115.96,22.7 178.22,22.7 183.95,16.97 187.51,16.97 193.38,22.84 208.9,22.84 209.17,22.56 210.69,22.56 211.03,22.9 248.03,22.9 248.63,22.29 249.52,22.29 v249.54,22.27 | v250.08,30.47 250.08,31.9 251.29,33.12 251.29,34.78 256.74,40.23 258.4,40.23 265,46.83 271.82,46.83 273.64,48.65 274,48.65 284.34,58.99 284.34,74.97 282.69,76.62 282.28,76.62
D+  (via drill 0.35)  (1 unrouted)
  Top 0.305: v110.01,14.27 110.01,14.29 109.19,15.12 109.19,17.83 v110.55,19.2
  Bottom 0.305: J3.A6 28.32,98.07 | 28.32,98.07 28.54,98.28 29.12,98.28 29.32,98.08 J3.B6 | 28.32,98.07 28.32,100.57 27.66,101.23 7.81,101.23 3.23,96.65 3.23,8.76 6.22,5.77 72.14,5.77 79.63,13.26 108.36,13.26 109.37,14.27 v110.01,14.27 | v110.55,19.2 110.68,19.33 IC3.D+
D-  (via drill 0.35)  (1 unrouted)
  Top 0.305: v110.1,15.25 109.67,15.68 109.67,17.54 110.35,18.22 v110.55,18.22
  Bottom 0.305: J3.A7 28.82,96.41 28.61,96.2 28.07,96.2 27.82,96.44 J3.B7 27.83,100.26 27.32,100.78 8,100.78 3.68,96.46 3.68,8.95 6.41,6.22 71.95,6.22 79.44,13.72 108.17,13.72 109.7,15.25 v110.1,15.25 | v110.55,18.22 110.56,18.23 IC3.D-
G_BAT  (via drill 0.35)
  Top 0.305: v124.5,3.21 124.22,3.21 120.18,7.25 118.17,7.25 117.16,8.27 117.16,9.21 117.51,9.56 v117.87,9.56
  Top 0.508: v169.68,5.4 168.69,4.41 151.98,4.41 150.34,6.04 146.06,6.04 144.42,4.41 v126.23,4.41
  Bottom 0.305: Q4.3 118.95,13.53 118.47,13.53 118.29,13.36 118.29,11.55 119.11,10.74 IC4.6 117.88,9.55 v117.87,9.56 | v124.5,3.21 C5.2
  Bottom 0.508: J4.2 171.44,8.22 CN2.2 171.73,7.45 v169.68,5.4 | C5.2 v126.22,4.41 v126.23,4.41
GND  (via drill 0.35)  (33 unrouted)
  Top 0.305: v97.24,21.73 97.24,27.37 97.5,27.62
  Bottom 0.305: U$63.3 115.3,18.47 C4.2 115.43,17.41 115.43,16.88 | IC3.GND1 112.89,22.64 v112.89,22.75 | 115.15,15.95 115.45,15.95 115.48,15.93 U$63.1 118.36,15.93 v118.5,16.07 | v115.66,14.56 114.94,13.85 R13.1 | R17.1 124.15,13.86 R16.1 | R20.2 119.97,3.08 v119.9,3.01 | U2.2 103.55,3.81 103.98,3.81 104.18,4.01 104.18,4.81 103.98,5.02 100.49,5.02 98.93,3.46 C6.2 98.71,5.87 97.68,6.9 97.68,7.04 IC3.GND 97.23,4.09 96.81,3.67 87.18,3.67 86.85,3.34 82.66,3.34 82,4 | IC3.GND2 97.23,21.72 v97.24,21.73
  Bottom 0.508: J3.GND2 31.98,97.25 J3.SHLD4 | J3.GND 25.17,97.25 J3.SHLD1
  other vias: 6.72,83.53 291.02,76.97 279.62,87.06 279.62,84.39 7.58,96.91 283.5,67.88 264.2,48.58 283.68,23.58 290.64,16.32 272.63,8.37 271.89,27.85 247.46,27.93 178.27,27.85 133.64,8.83 116.47,21.98 34.4,10.88
  pour Bottom: -0.95,104.46 291.15,104.46 294.96,100.65 294.96,2.86 292.42,0.32 110.81,0.32 110.81,26.99 82.87,26.99 82.87,0.32 4.13,0.32 0.32,4.13 0.32,103.19
  pour Top: 4.13,104.46 291.15,104.46 294.96,100.65 294.96,4.13 291.15,0.32 112.08,0.32 112.08,26.99 82.87,26.99 82.87,0.32 4.13,0.32 0.32,4.13 0.32,100.65
N$1
  Bottom 0.152: U$1.1 6.92,87.29 D1.A
N$2
  Bottom 0.152: LED1.C R1.2
N$3
  Bottom 0.152: U$14.1 264.09,87.29 D14.A
N$4
  Bottom 0.152: U$13.1 235.52,87.29 D13.A
N$5
  Bottom 0.152: U$12.1 216.47,87.29 D12.A
N$6
  Bottom 0.152: U$11.1 197.42,87.29 D11.A
N$7
  Bottom 0.152: U$10.1 178.37,87.29 D10.A
N$8
  Bottom 0.152: U$9.1 159.32,87.29 D9.A
N$9
  Bottom 0.152: U$8.1 140.27,87.29 D8.A
N$10
  Bottom 0.152: U$7.1 121.22,87.29 D7.A
N$11
  Bottom 0.152: U$6.1 102.17,87.29 D6.A
N$12
  Bottom 0.152: U$5.1 83.12,87.29 D5.A
N$13
  Bottom 0.152: U$4.1 64.07,87.29 D4.A
N$14
  Bottom 0.152: U$3.1 45.02,87.29 D3.A
N$15
  Bottom 0.152: U$2.1 25.97,87.29 D2.A
N$16
  Bottom 0.152: U$15.1 11.68,68.24 D15.A
N$17  (1 unrouted)
  Bottom 0.152: J1.1 96.68,20.3 96.68,19.65 98.25,18.08 IC3.P1.07
N$18
  Bottom 0.152: U$28.1 268.85,68.24 D28.A
N$19
  Bottom 0.152: U$27.1 245.04,68.24 D27.A
N$20
  Bottom 0.152: U$26.1 225.99,68.24 D26.A
N$21
  Bottom 0.152: U$25.1 206.94,68.24 D25.A
N$22
  Bottom 0.152: U$24.1 187.89,68.24 D24.A
N$23
  Bottom 0.152: U$23.1 168.87,68.22 D23.A
N$24
  Bottom 0.152: U$22.1 149.79,68.24 D22.A
N$25
  Bottom 0.152: U$21.1 130.74,68.24 D21.A
N$26
  Bottom 0.152: U$20.1 111.69,68.24 D20.A
N$27
  Bottom 0.152: U$19.1 92.64,68.24 D19.A
N$28
  Bottom 0.152: U$18.1 73.59,68.24 D18.A
N$29
  Bottom 0.152: U$17.1 54.54,68.24 D17.A
N$30
  Bottom 0.152: U$16.1 35.49,68.24 D16.A
N$31
  Bottom 0.152: U$29.1 14.06,49.19 D29.A
N$32  (1 unrouted)
  Bottom 0.152: IC3.P1.05 99.99,17.53 99.99,17.5 99.87,17.38 98.33,17.38 J1.2
N$33
  Bottom 0.152: U$41.1 261.71,49.19 D41.A
N$34
  Bottom 0.152: U$40.1 230.76,49.19 D40.A
N$35
  Bottom 0.152: U$39.1 211.7,49.19 D39.A
N$36
  Bottom 0.152: U$38.1 192.66,49.19 D38.A
N$37
  Bottom 0.152: U$37.1 173.6,49.19 D37.A
N$38
  Bottom 0.152: U$36.1 154.56,49.19 D36.A
N$39
  Bottom 0.152: U$35.1 135.51,49.19 D35.A
N$40
  Bottom 0.152: U$34.1 116.46,49.19 D34.A
N$41
  Bottom 0.152: U$33.1 97.41,49.19 D33.A
N$42
  Bottom 0.152: U$32.1 78.35,49.19 D32.A
N$43
  Bottom 0.152: U$31.1 59.3,49.19 D31.A
N$44
  Bottom 0.152: D30.A 40.26,49.19 U$30.1
N$45
  Bottom 0.152: U$42.1 18.82,30.14 D42.A
N$46  (1 unrouted)
  Bottom 0.152: IC3.P0.24 101.09,17.53 101.09,17.5 100.69,17.1 97.34,17.1 J1.3
N$47
  Bottom 0.152: U$53.1 256.95,30.14 D53.A
N$48
  Bottom 0.152: U$52.1 221.23,30.14 D52.A
N$49
  Bottom 0.152: U$51.1 202.18,30.14 D51.A
N$50
  Bottom 0.152: U$50.1 183.13,30.14 D50.A
N$51
  Bottom 0.152: U$49.1 164.08,30.14 D49.A
N$52
  Bottom 0.152: U$48.1 145.03,30.14 D48.A
N$53
  Bottom 0.152: U$47.1 125.98,30.14 D47.A
N$54
  Bottom 0.152: U$46.1 106.93,30.14 D46.A
N$55
  Bottom 0.152: U$45.1 87.88,30.14 D45.A
N$56
  Bottom 0.152: U$44.1 68.83,30.14 D44.A
N$57
  Bottom 0.152: U$43.1 49.78,30.14 D43.A
N$58
  Bottom 0.152: U$54.1 9.3,11.09 D54.A
N$59  (1 unrouted)
  Bottom 0.152: IC3.P0.20 102.72,18.08 101.46,16.82 96.35,16.82 J1.4
N$60
  Bottom 0.152: U$61.1 271.24,11.09 D61.A
N$61
  Bottom 0.152: U$60.1 247.42,11.09 D60.A
N$62
  Bottom 0.152: U$59.1 223.61,11.09 D59.A
N$63
  Bottom 0.152: D58.A 199.8,11.09 U$58.1
N$64
  Bottom 0.152: U$57.1 128.36,11.09 D57.A
N$65
  Bottom 0.152: U$56.1 56.92,11.09 D56.A
N$66
  Bottom 0.152: U$55.1 33.11,11.09 D55.A
N$67  (1 unrouted)
  Bottom 0.152: IC3.P0.17 103.82,18.08 102.28,16.54 95.36,16.54 J1.5
N$72  (via drill 0.35)
  Top 0.305: v27.55,95.23 26.72,95.23 26.06,94.57 25.22,94.57 22.67,97.12 22.67,98.69 26.45,102.48 v29.35,102.48
  Bottom 0.305: J3.B5 30.28,97.2 30.28,96.4 29.6,95.72 28.41,95.72 27.92,95.23 v27.55,95.23 | R11.2 32.55,99.73 32.08,100.19 31.64,100.19 v29.35,102.48
N$73  (via drill 0.35)
  Top 0.305: v27.04,99.99 28.05,99.99 31.53,103.47 33.82,103.47 v33.97,103.31
  Bottom 0.305: J3.A5 27.32,99.7 v27.04,99.99 | v33.97,103.31 34.08,103.31 R12.2
N$74  (via drill 0.35)
  Top 0.305: v117.46,14.56 117.54,14.64 v117.54,17.21
  Bottom 0.305: R13.2 117.46,14.34 v117.46,14.56 | v117.54,17.21 116.27,17.21 U$63.2
N$75  (via drill 0.35)
  Top 0.305: v122.57,15.24 124.51,17.18 v125.95,17.18
  Bottom 0.305: LED2.C v122.56,15.25 v122.57,15.24 | v125.95,17.18 124.71,17.18 R14.1
N$76
  Bottom 0.305: R14.2 U$63.7
N$77
  Bottom 0.305: IC4.1 121.61,10.56 122.6,11.55 122.6,13.36 122.43,13.53 121.94,13.53 Q4.6
N$78
  Bottom 0.305: Q4.4 121.6,11.19 120.7,10.3 120.7,8.17 120.88,7.99 121.26,7.99 IC4.3
N$79  (via drill 0.35)
  Top 0.305: v117.87,8.6 118.66,7.81 v126.07,7.81
  Bottom 0.305: IC4.5 v117.87,8.6 | v126.07,7.81 R15.1 124.5,7.44 C5.1
N$80
  Bottom 0.305: IC4.2 122.21,8.6 122.95,9.34 123.66,9.34 124.15,9.82 R16.2
N$81  (via drill 0.35)
  Top 0.305: v120.36,19.21 120.36,13.05 116.7,9.4 116.7,7.73 110.78,1.82 106.79,1.82 106.64,1.97 v101.1,1.97
  Bottom 0.305: Q5.2 122.18,19.44 121.96,19.22 v120.36,19.22 v120.36,19.21 | U2.1 101.65,2.51 v101.1,1.97 100.41,2.66 C6.1 | U2.3 103.19,4.42 102.55,4.42 101.59,3.46 C6.1 | D63.1 99.48,2.53 C6.1
POWER_PIN  (1 unrouted)
  Bottom 0.305: 107.12,18.07 IC3.P0.13
RESET  (via drill 0.35)  (3 unrouted)
  Top 0.305: v108.78,12.66 106.03,15.4 v106.03,16.62 | PROG1.3 v158.06,15.95 158.06,23.47 v155.18,26.35 | v103.07,24.42 104.26,23.24 104.26,21.07 104.66,20.67 110.41,20.67 111.21,21.47 115.56,21.47 115.96,21.07 115.96,20.51 115.56,20.11 114.45,20.11 v110.45,16.11
  Bottom 0.152: v158.06,15.95 158.04,15.94 S1.A2 156.66,15.9 R2.2
  Bottom 0.305: IC3.P0.16 107.79,18.53 107.79,18.71 107.61,18.89 106.66,18.89 106.48,18.71 106.48,18.53 IC3.P0.14 106.03,18.08 v106.03,16.62 | v108.78,12.66 109.7,13.58 110.3,13.58 110.78,14.07 110.78,15.31 111.5,16.03 IC3.P0.18 111.56,16.11 v110.45,16.11 | v155.18,26.35 154.96,26.12 143.34,26.12 142.43,27.04 141.11,27.04 140.5,26.43 105.08,26.43 v103.07,24.42
ROW1  (via drill 0.35)  (1 unrouted)
  Top 0.152: v279.44,85.71 281.5,85.71 v281.52,85.74
  Bottom 0.152: D1.C 26.46,85.72 26.95,85.24 28.12,85.24 28.61,85.72 D2.C 45.51,85.72 46,85.24 47.17,85.24 47.66,85.72 D3.C 64.56,85.72 65.05,85.24 66.22,85.24 66.71,85.72 D4.C 83.61,85.72 84.1,85.24 85.27,85.24 85.76,85.72 D5.C 102.66,85.72 103.15,85.24 104.32,85.24 104.81,85.72 D6.C 121.71,85.72 122.2,85.24 123.37,85.24 123.86,85.72 D7.C 140.76,85.72 141.25,85.24 142.42,85.24 142.91,85.72 D8.C 159.81,85.72 160.3,85.24 161.47,85.24 161.96,85.72 D9.C 178.86,85.72 179.35,85.24 180.52,85.24 181.01,85.72 D10.C 197.91,85.72 198.4,85.24 199.57,85.24 200.06,85.72 D11.C 216.96,85.72 217.45,85.24 218.62,85.24 219.11,85.72 D12.C 236.01,85.72 236.5,85.24 237.67,85.24 238.16,85.72 D13.C 264.58,85.72 265.07,85.24 266.25,85.24 266.74,85.72 D14.C 279.43,85.72 v279.44,85.71 | v281.52,85.74 281.94,85.32 284.68,85.32 292.32,77.68 292.32,7.45 286.02,1.16 203.27,1.16 196.42,8 193.6,8 186.75,1.16 153.11,1.16 151.78,2.49 151.78,3.1 148.78,6.1 146.9,6.1 144.26,3.46 144.26,2.63 142.78,1.16 111.47,1.16 106.03,6.59 IC3.P0.29
ROW2  (via drill 0.35)  (1 unrouted)
  Top 0.152: v283.53,66.64 285.13,66.64 v285.15,66.66
  Bottom 0.152: D15.C 35.98,66.67 36.47,66.19 37.65,66.19 38.14,66.67 D16.C 55.03,66.67 55.52,66.19 56.7,66.19 57.19,66.67 D17.C 74.08,66.67 74.57,66.19 75.75,66.19 76.24,66.67 D18.C 93.13,66.67 93.62,66.19 94.8,66.19 95.29,66.67 D19.C 112.18,66.67 112.67,66.19 113.85,66.19 114.34,66.67 D20.C 131.23,66.67 131.72,66.19 132.9,66.19 133.39,66.67 D21.C 150.28,66.67 150.77,66.19 151.95,66.19 152.44,66.67 D22.C 169.33,66.67 169.82,66.19 171,66.19 171.49,66.67 D23.C 188.38,66.67 188.87,66.19 190.05,66.19 190.54,66.67 D24.C 207.43,66.67 207.92,66.19 209.1,66.19 209.59,66.67 D25.C 226.48,66.67 226.97,66.19 228.15,66.19 228.64,66.67 D26.C 245.53,66.67 246.02,66.19 247.2,66.19 247.69,66.67 D27.C 269.35,66.67 269.83,66.19 271.01,66.19 271.5,66.67 D28.C 283.49,66.67 v283.53,66.64 | v285.15,66.66 292.01,59.8 292.01,7.58 285.9,1.46 203.39,1.46 196.55,8.31 193.47,8.31 186.62,1.46 153.24,1.46 152.08,2.62 152.08,3.23 148.91,6.4 146.77,6.4 143.95,3.58 143.95,2.76 142.66,1.46 111.87,1.46 107.13,6.2 IC3.P0.30
ROW3  (via drill 0.35)  (1 unrouted)
  Top 0.152: v271.44,47.74 274.79,47.74 v274.87,47.66
  Bottom 0.152: D29.C 40.75,47.62 41.23,47.14 42.41,47.14 42.9,47.62 D30.C 59.8,47.62 60.28,47.14 61.46,47.14 61.95,47.62 D31.C 78.85,47.62 79.33,47.14 80.51,47.14 81,47.62 D32.C 97.9,47.62 98.38,47.14 99.56,47.14 100.05,47.62 D33.C 116.95,47.62 117.43,47.14 118.61,47.14 119.1,47.62 D34.C 136,47.62 136.48,47.14 137.66,47.14 138.15,47.62 D35.C 155.05,47.62 155.53,47.14 156.71,47.14 157.2,47.62 D36.C 174.1,47.62 174.58,47.14 175.76,47.14 176.25,47.62 D37.C 193.15,47.62 193.63,47.14 194.81,47.14 195.3,47.62 D38.C 212.2,47.62 212.68,47.14 213.86,47.14 214.35,47.62 D39.C 231.25,47.62 231.73,47.14 232.91,47.14 233.4,47.62 D40.C 262.2,47.62 262.69,47.14 263.87,47.14 264.36,47.62 D41.C 265.48,47.74 v271.44,47.74 | v274.87,47.66 281.85,47.66 291.71,37.81 291.71,7.7 285.77,1.76 203.52,1.76 196.67,8.61 193.34,8.61 186.5,1.76 153.37,1.76 152.39,2.75 152.39,3.35 149.04,6.71 146.65,6.71 143.65,3.71 143.65,2.88 142.53,1.76 112.51,1.76 108.23,6.04 IC3.P0.31
ROW4  (1 unrouted)
  Bottom 0.152: D42.C 50.27,28.57 50.76,28.09 51.94,28.09 52.42,28.57 D43.C 69.32,28.57 69.81,28.09 70.99,28.09 71.47,28.57 D44.C 88.37,28.57 88.86,28.09 90.04,28.09 90.52,28.57 D45.C 107.42,28.57 107.91,28.09 109.09,28.09 109.57,28.57 D46.C 126.47,28.57 126.96,28.09 128.14,28.09 128.62,28.57 D47.C 145.52,28.57 146.01,28.09 147.19,28.09 147.67,28.57 D48.C 164.57,28.57 165.06,28.09 166.24,28.09 166.72,28.57 D49.C 183.62,28.57 184.11,28.09 185.29,28.09 185.77,28.57 D50.C 202.67,28.57 203.16,28.09 204.34,28.09 204.82,28.57 D51.C 221.72,28.57 222.21,28.09 223.39,28.09 223.87,28.57 D52.C 257.44,28.57 257.93,28.09 259.1,28.09 259.59,28.57 D53.C 279.7,28.57 291.4,16.87 291.4,7.83 285.64,2.07 203.65,2.07 196.8,8.91 193.22,8.91 186.37,2.07 153.49,2.07 152.69,2.87 152.69,3.48 149.16,7.01 146.52,7.01 143.34,3.84 143.34,3.01 142.4,2.07 113.12,2.07 110.43,4.76 110.43,7.47 IC3.P0.05
ROW5  (via drill 0.35)  (1 unrouted)
  Top 0.152: v131.51,3.14 129.73,1.36 82.4,1.36 81.17,2.59 81.17,3.94 79.74,5.36 77.1,5.36 75.84,4.1 75.84,2.48 74.73,1.36 70.22,1.36 v62.04,9.54
  Bottom 0.152: D54.C 33.6,9.53 34.09,9.04 35.27,9.04 35.76,9.53 D55.C 57.41,9.53 57.9,9.04 59.08,9.04 59.57,9.53 D56.C 62.03,9.53 v62.04,9.54 | IC3.P0.07 111.64,9.44 113.47,9.44 114.08,8.83 114.08,3.87 115.58,2.38 142.28,2.38 143.04,3.14 143.04,3.96 146.39,7.32 149.29,7.32 153,3.61 153,3 153.62,2.38 186.25,2.38 193.09,9.22 196.93,9.22 203.77,2.38 267.73,2.38 D61.C 273.88,9.53 273.39,9.04 272.22,9.04 271.73,9.53 D60.C 250.07,9.53 249.58,9.04 248.4,9.04 247.91,9.53 D59.C 226.26,9.53 225.77,9.04 224.59,9.04 224.1,9.53 D58.C 202.44,9.53 201.95,9.04 200.78,9.04 200.29,9.53 192.98,9.53 186.14,2.68 153.77,2.68 153.3,3.15 153.3,3.73 149.44,7.59 146.28,7.59 142.74,4.05 142.74,3.26 142.15,2.68 140.82,2.68 133.97,9.53 D57.C 132.01,3.64 v131.51,3.14
SCK  (via drill 0.35)  (1 unrouted)
  Top 0.305: PROG1.5 163.14,20.48 v157.94,25.68
  Bottom 0.305: v157.94,25.68 157.47,25.21 142.96,25.21 142.05,26.12 141.49,26.12 140.88,25.51 105.78,25.51 103.83,23.57 IC3.SWDCLK
SWD  (via drill 0.35)  (1 unrouted)
  Top 0.305: PROG1.4 160.6,22.02 v156.73,25.89
  Bottom 0.305: v156.73,25.89 156.5,25.67 143.15,25.67 142.24,26.58 141.3,26.58 140.69,25.97 105.59,25.97 102.73,23.12 IC3.SWDIO
V_BATT
  Bottom 0.305: R19.1 122.42,4.63 123.28,5.49 123.28,6.74 123.17,6.84 R15.2 126.08,10.71 126.08,15.1 125.9,15.28 125.13,15.28 123.89,16.52 123.89,17.87 124.27,18.25 Q5.3 123.32,21.64 U$63.5
  Bottom 0.508: CN2.1 173.98,8.18 J4.1 169.2,22.21 124.85,22.21 Q5.3
V_USB  (via drill 0.35)  (1 unrouted)
  Top 0.305: v115.28,20.79 111.18,20.79 108.4,18.01 108.4,16.67 v108.5,16.57 | v96.3,6.57 96.3,13.86 v98.16,15.71 | v125.31,12.99 126.71,14.39 126.71,19.27 v126.56,19.42
  Top 0.635: v32.96,95.57 32.45,96.08 26.61,96.08 v25.78,95.25
  Bottom 0.305: 114.88,19.66 C4.1 114.83,20.34 v115.28,20.79 | 114.88,19.66 114.88,19.55 114.03,18.7 114.03,17.23 114.51,16.75 LED2.A | 114.88,19.66 114.88,19.74 U$63.4 120.07,15.93 U$63.8 123.78,15.93 R17.2 125.28,13.03 v125.31,12.99 | v108.5,16.57 108.5,15.4 108.45,15.35 | D63.2 96.66,6.21 v96.3,6.57 | v98.16,15.71 97.12,14.67 96.33,14.67 | v126.56,19.42 125.24,19.42 Q5.1
  Bottom 0.635: J3.VBUS1 26.13,95.59 v25.78,95.25 25.46,94.93 24.38,94.93 20.82,98.49 | IC3.VBUS 110.22,17.13 108.45,15.35 107.76,14.67 | J3.VBUS2 31.03,96.33 31.79,95.57 v32.96,95.57
  Bottom 1.27: 20.82,98.49 7.05,98.49 4.64,96.08 4.64,9.34 6.79,7.18 71.56,7.18 79.06,14.67 96.33,14.67 107.76,14.67
VDD_NRF  (via drill 0.35)  (1 unrouted)
  Top 0.305: v107.07,2.5 109.05,2.5 v113.03,6.49 | v141.85,3.29 132.32,3.29 131.76,3.85 126.83,3.85 125.03,2.04 114.85,2.04 v113.63,3.26
  Bottom 0.152: PROG1.1 152.68,12.31 R2.1
  Bottom 0.305: IC3.VDD_NRF 113.03,6.93 v113.03,6.49 113.03,3.86 v113.63,3.26 | U2.5 107.06,2.51 v107.07,2.5 | PROG1.1 150.16,12.01 141.85,3.7 v141.85,3.29

### Text on the board
bNames: + - | 3V3 | RST | SCK | GND | SWD